# Altium schematic sheet Alimentacion.SchDoc
size A4
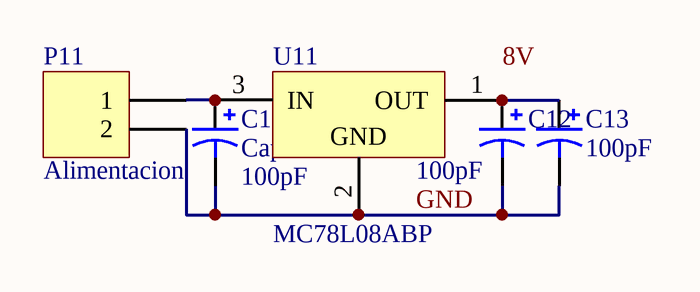
[diagram p0: Alimentacion.SchDoc]

## Parts
C11  Cap Pol3  value 100pF  [C0805]
C12  value 100pF  [C0805]  (hidden comment: Cap Pol3)
C13  value 100pF  [C0805]  (hidden comment: Cap Pol3)
P11  Alimentacion  [HDR1X2]
U11  MC78L08ABP  [29-04]

## Nets
GND: C11.2 C12.2 C13.2 P11.2 U11.2(GND)
NetC11_1: C11.1 P11.1 U11.3(IN)
NetC12_1: C12.1 C13.1 U11.1(OUT)

## Notes on the sheet
- Labels drawn without touching a wire or pin: 8V

## Library data of the parts
C11-C13 = Cap Pol3: Polarized Capacitor (Surface Mount); Published: 8-Jun-2000; LatestRevisionDate: 17-Jul-2002; LatestRevisionNote: Re-released for DXP Platform.; PackageReference: C0805; Publisher: Altium Limited
P11 = Header 2: Header, 2-Pin; LatestRevisionDate: 17-Jul-2002; LatestRevisionNote: Re-released for DXP Platform.; Publisher: Altium Limited
U11 = MC78L08ABP: 3-Terminal Low-Current Positive Fixed Voltage Regulator; PackageDocument: 1996; Published: 17-Jul-2002; DatasheetDocument: 1988; PackageReference: 29-04; Publisher: Altium Limited; ComponentLink1Description: Manufacturer Link; ComponentLink1URL: http://www.onsemi.com/site/products/taxonomy/0,4438,503,00.html; ComponentLink2Description: Datasheet; ComponentLink2URL: http://www.onsemi.com/pub/Collateral/MC78L00A-D.PDF